# Altium project TP1-Boost.PrjPcb
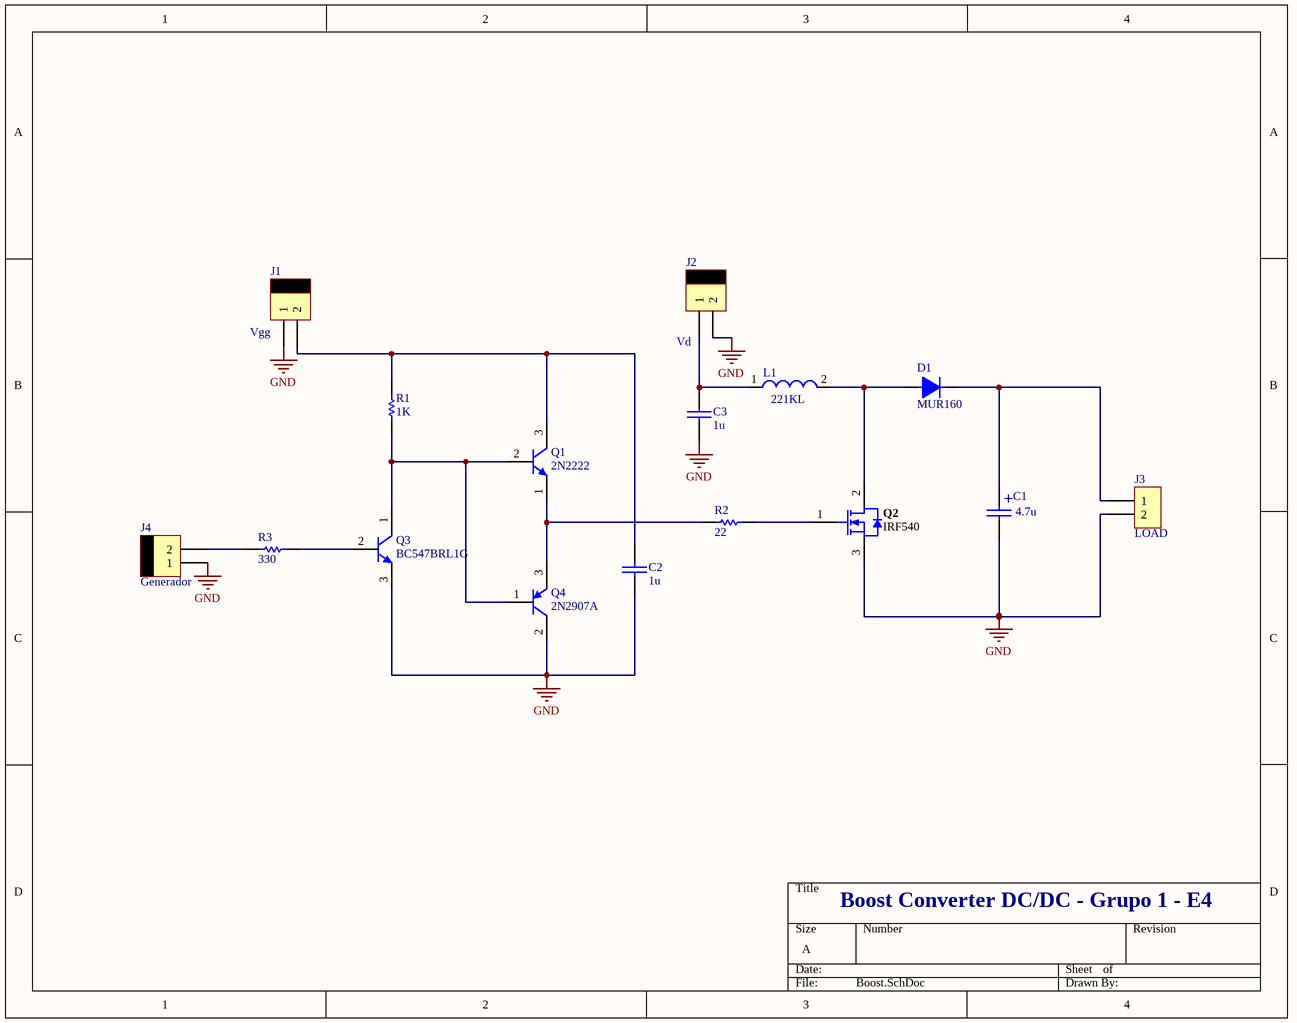
[diagram p0: Boost.SchDoc]
1 sheet, 16 parts. Net scope: global (net labels, ports and power ports of the same name join across sheets).
Board file: Boost.PcbDoc

## Sheet Boost.SchDoc
size A; SheetNumber: 1; SheetTotal: 1

### Parts
C1  4.7u  [CAP100RP]
C2  1u  [0805]
C3  1u  [0805]
D1  MUR160  [DO41]
J1  Vgg  [MOLEX2]
J2  Vd  [MOLEX2]
J3  LOAD  [BORNERA2]
J4  Generador  [MOLEX2]
L1  221KL  [WE-TI-L]
Q1  2N2222  [MLTC-TO-18-3]
Q2  IRF540  [VISH-TO-220AB-3_A]
Q3  BC547BRL1G  [ONSC-TO-92-3-29-11_AM_BL]
Q4  2N2907A  [STM-TO-18-3]
R1  1K  [0805]
R2  22  [RES400]
R3  330  [0805]

### Nets
GND: C1.2 C2.1 C3.1 J1.1 J2.2 J3.2 J4.1 Q2.3(S) Q3.3(E) Q4.2(C)
NetC1_1: C1.1 D1.2 J3.1
NetC2_2: C2.2 J1.2 Q1.3(C) R1.2
NetC3_2: C3.2 J2.1 L1.1
NetD1_1: D1.1 L1.2 Q2.2(D)
NetJ4_2: J4.2 R3.1
NetQ1_1: Q1.1(E) Q4.3(E) R2.1
NetQ1_2: Q1.2(B) Q3.1(C) Q4.1(B) R1.1
NetQ2_1: Q2.1(G) R2.2
NetQ3_2: Q3.2(B) R3.2

### Notes on the sheet
- Boost Converter DC/DC - Grupo 1 - E4
- (in symbol CAPPOL) +

### Library data of the parts
C1 = CAPPOL
C2 C3 = CAP
D1 = DIODO
J1 J2 J4 = MOLEX2
J3 = BORNERA 2
L1 = CMP-0225-00044-1: Radial Leaded Wire Wound Inductor WE-TI, L = 22.0 µH; Inductance: 22.0 ÂµH; DatasheetVersion: ver 2, Dec-2004; ComponentLink2URL: http://www.we-online.de/katalog/media/pdf/744772220.pdf; PackageDescription: THT Inductor, 2-Leads, Body 7.8 x 7.8 mm; PackageReference: WE-TI-L; ComponentLink2Description: Datasheet; ComponentLink1Description: Manufacturer Link; ComponentLink1URL: http://www.we-online.com; PackageVersion: 2006
Q1 = CMP-2000-05237-1: Low Power Bipolar NPN Transistor, 30 V, -65 to 200 degC, 3-Pin TO-18, RoHS, Bulk; Manufacturer: Multicomp; Pin Configuration: a; No. of Pins: 3; No. of Transistors: 1; Collector Emitter Voltage Vces: 400mV; Current Ic Continuous a Max: 800mA; Power Dissipation Pd: 500mW; Collector Emitter Voltage V(br)ceo: 30V; Gain Bandwidth ft Typ: 250MHz; Voltage Vcbo: 60V; DC Current Gain hFE: 100; Full Power Rating Temperature: 25degC; Current Ic @ Vce Sat: 150mA; SVHC: NoSVHC(19-Dec-2012); Package Reference: TO-18-3; Package Description: 3-Pin Transistor Outline Package (TO-18), Dia 5.54 mm, Pitch Pitch 1.485mm; Datasheet URL: http://www.farnell.com/datasheets/1662272.pdf; Transistor Case Style: TO-18; Continuous Collector Current Ic Max: 800mA; Manufacturer URL: http://uk.farnell.com/b/multicomp; DC Collector Current: 800mA; Hfe Min: 100; Transistor Polarity: NPN; Power Dissipation Ptot Max: 500mW; Package / Case: TO-18; Datasheet Version: Rev. 1.1, 05/2012; Gain Bandwidth ft Min: 250MHz; Current Ic hFE: 150mA
Q2 = CMP-2000-06461-1: Power MOSFET, 100 VDS, -55 to 175 degC, 3-Pin TO-220AB, RoHS, Tube; Manufacturer: Vishay; Typical Turn-Off Delay Time: 53ns; Channel Mode: Enhancement; Unit Weight: 0.211644oz; Transistor Type: 1N-Channel; Vgs - Gate-Source Voltage: 20V; Transistor Polarity: N-Channel; Vds - Drain-Source Breakdown Voltage: 100V; Configuration: Single; Number of Channels: 1Channel; Pd - Power Dissipation: 150W; Brand: VishaySemiconductors; Rds On - Drain-Source Resistance: 77mOhms; Id - Continuous Drain Current: 28A; Rise Time: 44ns; Fall Time: 43ns; Typical Turn-On Delay Time: 11ns; &lt;PCN&gt;: http://www.mouser.com/PCN/Vishay_SIL_0182015.pdf; Maximum Operating Temperature: +175C; Product Category: MOSFET; Datasheet URL: http://www.vishay.com/docs/91021/91021.pdf; Length: 10.51mm; Height: 9.01mm; Factory Pack Quantity: 50; Width: 4.7mm; Packaging: Tube; Package Reference: TO-220AB-3; Package / Case: TO-220-3; Mounting Style: ThroughHole; Manufacturer URL: http://www.vishay.com/; Mounting Technology: ThroughHole; Package URL: http://www.vishay.com/docs/71195/to220ab.pdf; RoHS: NoRoHSVersionAvailable; Technology: Si; Minimum Operating Temperature: -55C; Package Description: 3-Pin Flange Mount, Body 10.275 x 4.45 mm, Pitch 2.54 mm; Datasheet Version: Rev. B, 03/2011
Q3 = CMP-1048-01605-1: Amplifier Transistor, NPN Silicon, 3-Pin TO-92, Pb-Free, Tape and Reel; Manufacturer: On Semiconductor; IC Continuous (A): 0.1; fT Min (MHz): 150; ComponentLink2URL: http://www.onsemi.com/pub_link/Collateral/BC546-D.PDF; ComponentLink1URL: http://www.onsemi.com/; ComponentLink2Description: Datasheet; RoHS: TRUE; ComponentLink3Description: Package Specification; ComponentLink1Description: Manufacturer URL; ComponentLink3URL: http://www.onsemi.com/pub_link/Collateral/MAC97-D.PDF; PackageDescription: 3-Pin Transistor Outline, Body 4.825 x 3.685 mm, Pitch 1.27 mm; Packing: Tape and Reel; PackageVersion: Rev. AM; Polarity: NPN; DatasheetVersion: Rev. 7; Mounting Technology: Through Hole; PackageReference: TO-92-3-29-11_AM_BL; PartNumber: BC547BRL1G
Q4 = CMP-2000-05561-1: Small Signal PNP Transistor, 0.4 W, 60 V, 600 mA, 3-Pin TO-18, RoHS, Bulk; Manufacturer: STMicroelectronics; Transition Frequency ft: 200MHz; Collector Emitter Voltage V(br)ceo: -60V; Power Dissipation Pd: 400mW; No. of Pins: 3Pins; SVHC: NoSVHC(17-Dec-2015); DC Collector Current: -600mA; DC Current Gain hFE: 300hFE; MSL: -; Operating Temperature Max: 175°C; Product Range: -; Datasheet Version: 02/2003; Automotive Qualification Standard: -; Transistor Case Style: TO-18; Manufacturer URL: http://www.st.com/; Mounting Technology: ThroughHole; Package Description: 3-Pin Through Hole Device, Dia 5.8 mm, Pitch 1.27 mm; Package Reference: TO-18-3; Datasheet URL: https://datasheet.ciiva.com/16614/cd00003088-16614659.pdf; Transistor Polarity: PNP
R1-R3 = RES